# EAGLE schematic apds9250 (EAGLE 8.4.2)
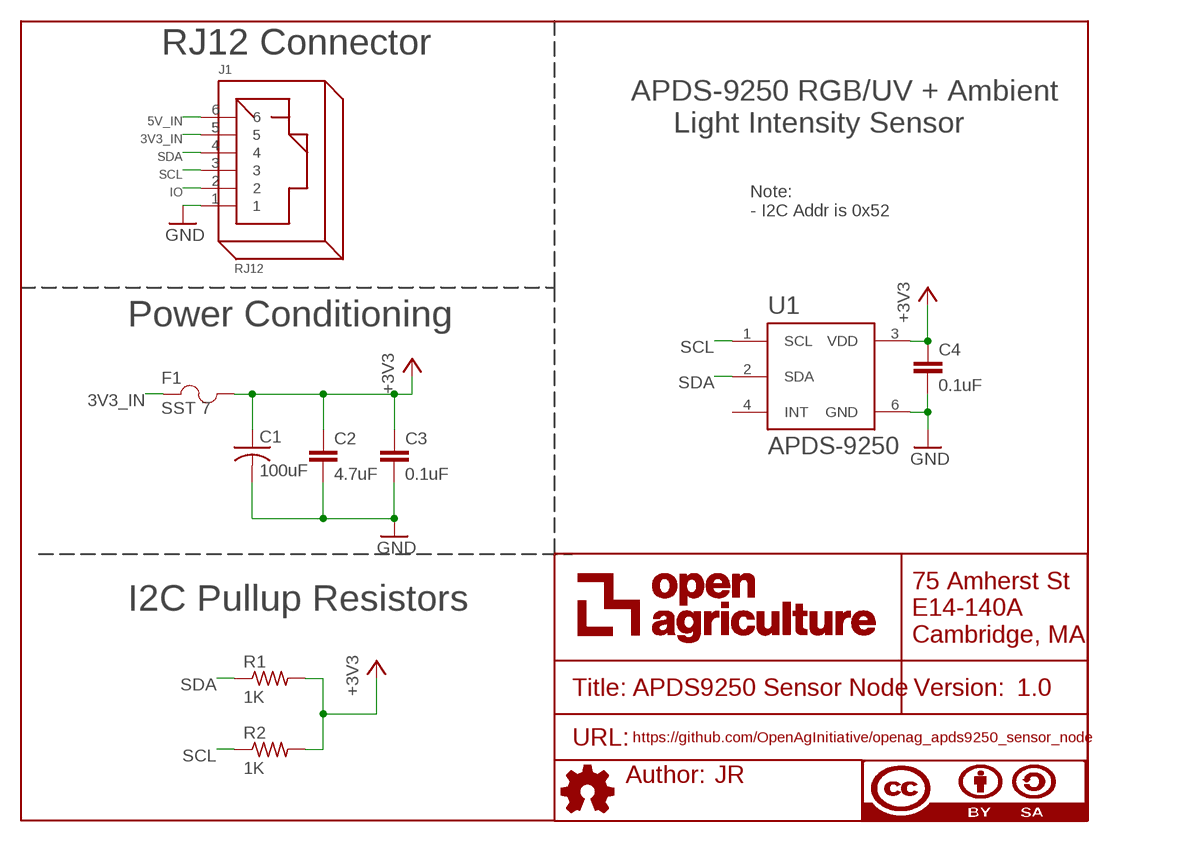
[diagram p0: schematic, sheet 1]

## Parts
C1  100uF  100UF-EEE-1HA101UP  [EEE-1HA101UP]
C2  4.7uF  4.7UF-CL21A475KBQNNNE  [C0805]
C3  0.1uF  0.1UF-C0603C104K5RACTU  [C0603]
C4  0.1uF  0.1UF-C0603C104K5RACTU  [C0603]
F1  SST 7  SST_7  [SS]
FRAME1  DOCFIELD  [DOCFIELD]
J1  RJ12  A-2004-1-4-LP-N-R  [RJ12]
R1  1K  1K-ERJ-PB3D1001V  [RC0603N]
R2  1K  1K-ERJ-PB3D1001V  [RC0603N]
U1  APDS-9250  [APDS-9250]

## Nets
3V3_IN: F1.1 J1.5
5V_IN: J1.6
+3V3: C1.+(1(+)) C2.1 C3.1 C4.1 F1.2 R1.2 R2.2 U1.3(VDD)
GND: C1.-(2(-)) C2.2 C3.2 C4.2 J1.1 U1.6(GND)
IO: J1.2
SCL: J1.3 R2.1 U1.1(SCL)
SDA: J1.4 R1.1 U1.2(SDA)
Unconnected: U1.4(INT)

## Notes on the sheet
- RJ12 Connector
- APDS-9250 RGB/UV + Ambient 
       Light Intensity Sensor
- Note:
  - I2C Addr is 0x52
- Power Conditioning
- I2C Pullup Resistors

## Library data of the parts
C1 = openag-capacitors:100UF-EEE-1HA101UP: Panasonic - EEE-1HA101UP - ELECTROLYTIC CAP ALUM 100UF 20% 50V SMD Description: 100µF 50V Aluminum Electrolytic Capacitors Radial, Can - SMD 2000 Hrs @ 85°C Technical Specifications: Capacitance: 100uF Tolerance: ±20% Rated Voltage: 50V Polarization: Polar Operating Temperature: -40°C ~ 85°C Datasheet(s): S Series, Type V <https://industrial.panasonic.com/cdbs/www-data/pdf/RDE0000/ABA0000C1145.pdf> Vendor(s): Digikey: PCE3917CT-ND <https://www.digikey.com/product-detail/en/panasonic-electronic-components/EEE-1HA101UP/PCE3917CT-ND/766293>; POPULATE: YES; VERIFIED: NO
C2 = openag-capacitors:4.7UF-CL21A475KBQNNNE: Samsung - CL21A475KBQNNNE - CAP CER 4.7UF 50V X5R 0805 Description: 4.7µF ±10% 50V Ceramic Capacitor X5R 0805 (2012 Metric) Technical Specifications: Capacitance: 4.7uF Tolerance: ±10% Rated Voltage: 50V Temperature Coefficient: X5R Operating Temperature: -55°C ~ 85°C Package/Case: 0805 (2012 Metric) Datasheet(s): CL21A475KBQNNNE Characteristics <http://www.samsungsem.com/kr/front/downloadcms.do?path=/kr/support/product-search/mlcc/__icsFiles/afieldfile/2014/11/05&fileName=C_CL21A475KBQNNNE.pdf> Vendor(s): Digikey: 1276-1248-1-ND <https://www.digikey.com/product-detail/en/samsung-electro-mechanics/CL21A475KBQNNNE/1276-1248-1-ND/3889334>; POPULATE: YES; VERIFIED: NO
C3 C4 = openag-capacitors:0.1UF-C0603C104K5RACTU: Kemet - C0603C104K5RACTU - CAP CER 0.1UF 50V X7R 0603 Description: 0.1µF ±10% 50V Ceramic Capacitor X7R 0603 (1608 Metric) Technical Specifications: Capacitance: 0.1µF Tolerance: ±10% Rated Voltage: 50V Temperature Coefficient: X7R Operating Temperature: -55°C ~ 125°C Package / Case: 0603 (1608 Metric) Datasheet(s): X7R Dielectric, 6.3-250 VDC <https://search.kemet.com/component-edge/download/datasheet/C0603C104K5RACTU.pdf> Vendor(s): Digikey: 399-5089-1-ND <https://www.digikey.com/product-detail/en/kemet/C0603C104K5RACTU/399-5089-1-ND/1465623>; POPULATE: YES; VERIFIED: NO
F1 = openag-fuses:SST_7: Bel Fuse - SST7 - FUSE BRD MNT 7A 125VAC/VDC 2SMD Description: FUSE BRD MNT 7A 125VAC/VDC 2SMD Technical Specifications: Current Rating: 7A Voltage Rating: 125V Fuse Type: Board Mount (Cartridge Style Excluded) Mounting Type: Surface Mount Operating Temperature: -55°C ~ 125°C Datasheet(s): SST Type <https://belfuse.com/resources/StewartConnector/SST.pdf> Vendor(s): Digikey: 507-1072-1-ND <https://www.digikey.com/product-detail/en/bel-fuse-inc/SST-7/507-1072-1-ND/615026>; POPULATE: YES; VERIFIED: NO
FRAME1 = openag-frames:DOCFIELD: DOCUMENT FIELD; AUTHOR: JR; DESCRIPTION: APDS-9250 RGB/UV + Ambient Light Intensity Sensor Node; TITLE: APDS9250 Sensor Node; URL: https://github.com/OpenAgInitiative/openag_apds9250_sensor_node; VER: 1.0
J1 = openag-connectors:A-2004-1-4-LP-N-R: Assmann WSW Components - A-2004-1-4-LP-N-R - CONN MOD JACK 6P6C R/A UNSHLD Description: Jack Modular Connector 6p6c (RJ11, RJ12, RJ14, RJ25) 90° Angle (Right) Unshielded Technical Specifications: Connector Type: Jack Number of Positions/Contacts: 6p6c (RJ11, RJ12, RJ14, RJ25) Number of Ports: 1 Number of Rows: 1 Mounting Type: Through Hole Orientation: 90° Angle (Right) Termination: Solder Shielding: Unshielded Features: Board Lock LED Color: Does Not Contain LED Tab Direction: Down Contact Material: Phosphor Bronze Contact Finish: Gold Contact Finish Thickness: 6µin (0.152µm) Housing Material: Polybutylene Terephthalate (PBT), Glass Filled Operating Temperature: -40°C ~ 85°C Datasheet(s): A-2004-1-4-LP-N Drawing <http://www.assmann-wsw.com/fileadmin/datasheets/ASS_7320_CO.pdf> Vendor(s): Digikey: AE10383-ND <https://www.digikey.com/product-detail/en/assmann-wsw-components/A-2004-1-4-LP-N-R/AE10383-ND/2183634>; POPULATE: YES; VERIFIED: NO
R1 R2 = openag-resistors:1K-ERJ-PB3D1001V: Panasonic - P20283CT-ND - RES SMD 1K OHM 0.5% 1/5W 0603 Description: 1 kOhms ±0.5% 0.2W, 1/5W Chip Resistor 0603 (1608 Metric) Automotive AEC-Q200, Pulse Withstanding Thick Film Technical Specifications: Resistance: 1 kOhms Tolerance: ±0.5% Power: 0.2W, 1/5W Operating Temperature: -55°C ~ 155°C Package / Case: 0603 (1608 Metric) Datasheet(s): ERJ-PB3, PB6 Series, High Precision Datasheet <https://industrial.panasonic.com/cdbs/www-data/pdf/RDM0000/AOA0000C328.pdf> Vendor(s): Digikey: P20283CT-ND <https://www.digikey.com/product-detail/en/panasonic-electronic-components/ERJ-PB3D1001V/P20283CT-ND/6214538>; POPULATE: YES; VERIFIED: NO
U1 = openag-sensors:APDS-9250: Broadcom Limited - APDS-9250 - DIGITAL RGB, IR AND ALS Description: Optical Sensor Ambient 550nm I²C 6-SMD Module Technical Specifications: Type: Ambient Wavelength: 550nm Proximity Detection: No Output Type: I²C Voltage - Supply: 1.7 V ~ 3.6 V Operating Temperature: -40°C ~ 85°C Mounting Type: Surface Mount Package / Case: 6-SMD Module Datasheet(s): APDS-9250 <https://docs.broadcom.com/docs/AV02-4733EN> Vendor(s): Digikey: 516-3293-1-ND <https://www.digikey.com/product-detail/en/broadcom-limited/APDS-9250/516-3293-1-ND/5761192>; POPULATE: YES; VERIFIED: NO